# Altium schematic sheet Power.SchDoc
size A4; SheetNumber: 3; SheetTotal: 6
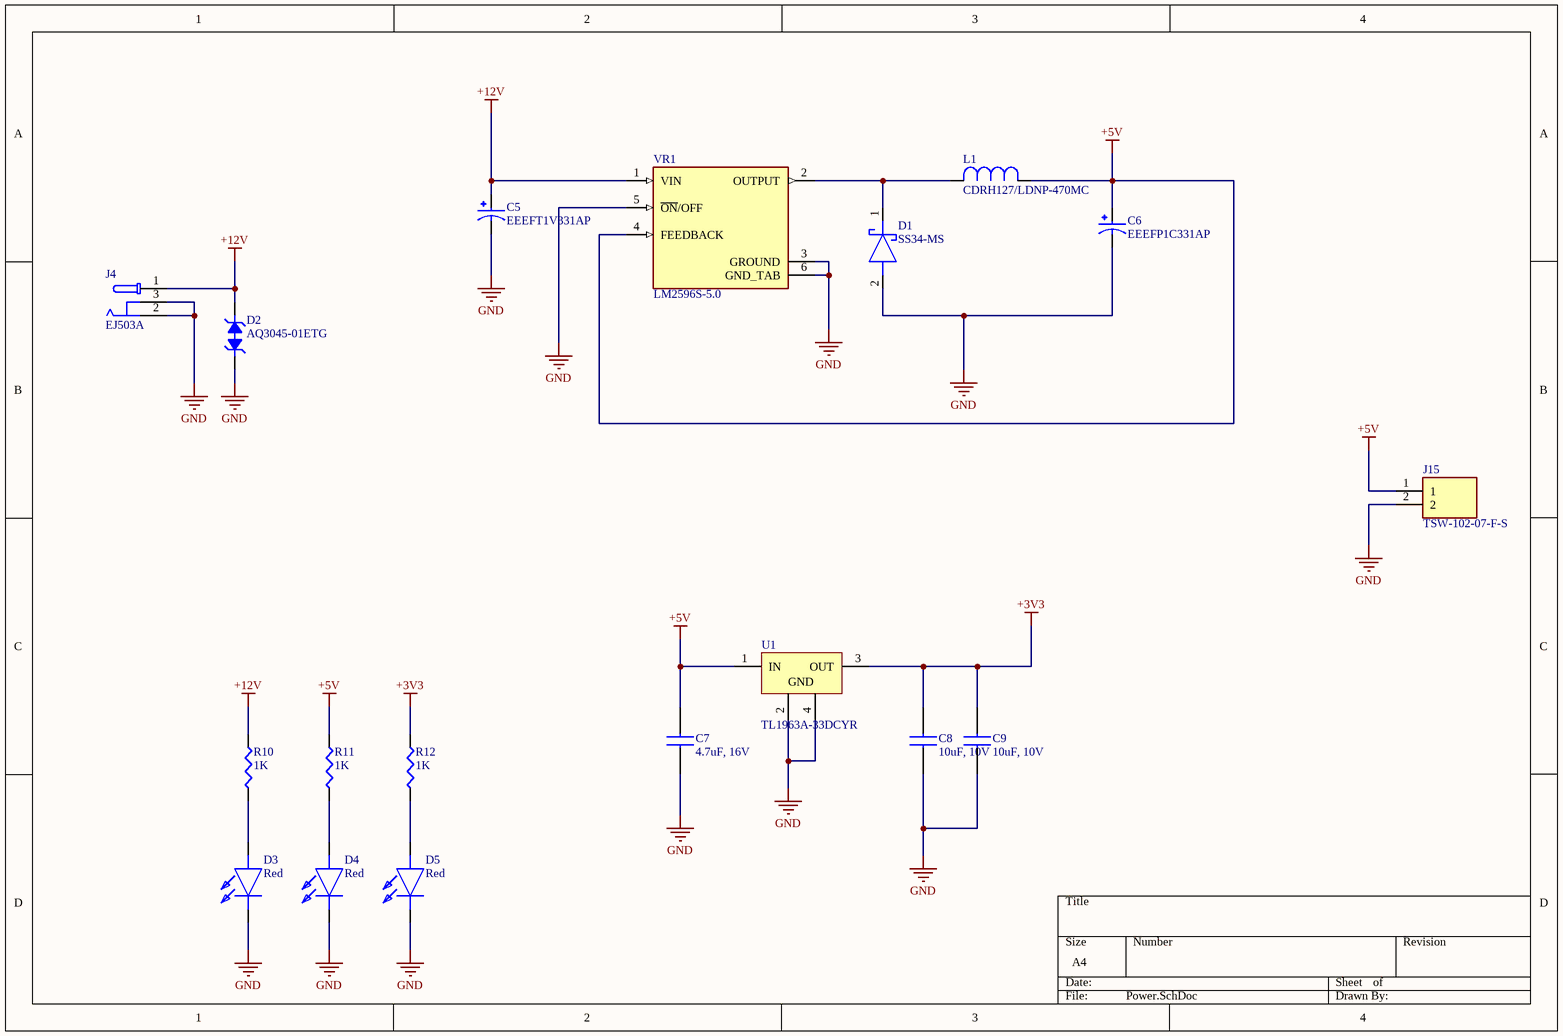
[diagram p0: Power.SchDoc]

## Parts
C5  EEEFT1V331AP  [CAP_EEEFT1V331AP]
C6  EEEFP1C331AP  [CAP_EEEFP1C331AP]
C7  4.7uF, 16V  [CAPC1608X90N]
C8  10uF, 10V  [CAPC1608X90N]
C9  10uF, 10V  [CAPC1608X90N]
D1  SS34-MS  [DIOM5127X241N]
D2  AQ3045-01ETG  [SOD882]
D3  Red  [LEDC1608X90N]
D4  Red  [LEDC1608X90N]
D5  Red  [LEDC1608X90N]
J4  EJ503A  [MPD_EJ503A]
J15  TSW-102-07-F-S  [TSW-102-XX-YY-S]
L1  CDRH127/LDNP-470MC  [IND_CDRH127/LDNP-470MC_SUM]
R10  1K  [RESC1607X60N]
R11  1K  [RESC1607X60N]
R12  1K  [RESC1607X60N]
U1  TL1963A-33DCYR  [DCY0004A_N]
VR1  LM2596S-5.0  [TO170P1524X483-6N]

## Nets
+3V3: C8.2 C9.2 R12.2 U1.3(OUT)
+5V: C6.1 C7.2 J15.1 L1.1 R11.2 U1.1(IN) VR1.4(FEEDBACK)
+12V: C5.1 D2.2 J4.1 R10.2 VR1.1(VIN)
GND: C5.2 C6.2 C7.1 C8.1 C9.1 D1.2(A) D2.1 D3.1(K) D4.1(K) D5.1(K) J4.2 J4.3 J15.2 U1.2(GND) U1.4(GND) VR1.3(GROUND) VR1.5(~{ON}/OFF) VR1.6(GND_TAB)
NetD1_1: D1.1(K) L1.2 VR1.2(OUTPUT)
NetD3_2: D3.2(A) R10.1
NetD4_2: D4.2(A) R11.1
NetD5_2: D5.2(A) R12.1

## Library data of the parts
C5 = EEEFT1V331AP: CAP ALUM 330UF 20% 35V SMD; MF: Panasonic Electronic; MP: EEE-FT1V331AP; SnapEDA_Link: https://www.snapeda.com/parts/EEE-FT1V331AP/Panasonic/view-part/?ref=snap; Package: RADIAL-2 Panasonic; Value: *; Check_prices: https://www.snapeda.com/parts/EEE-FT1V331AP/Panasonic/view-part/?ref=eda
C6 = EEEFP1C331AP: CAP ALUM 330UF 20% 16V SMD; MF: Panasonic Electronic; MP: EEE-FP1C331AP; SnapEDA_Link: https://www.snapeda.com/parts/EEE-FP1C331AP/Panasonic/view-part/?ref=snap; Package: RADIAL-2 Panasonic; Value: *; Check_prices: https://www.snapeda.com/parts/EEE-FP1C331AP/Panasonic/view-part/?ref=eda
C7 = CL10A475KO8NNNC: CAP CER 4,7UF 16V X5R 0603; Manufacturer_Name: SAMSUNG; Datasheet Link: https://componentsearchengine.com/Datasheets/2/CL10A106MP8NNNC.pdf; Height: 0.9mm; Manufacturer_Part_Number: CL10A475KO8NNNC; Mouser Part Number: 187-CL10A106MP8NNNC; Mouser Price/Stock: https://www.mouser.co.uk/ProductDetail/Samsung-Electro-Mechanics/CL10A106MP8NNNC?qs=X6jEic%2FHinAgjcVTZfg7UA%3D%3D; Arrow Part Number: CL10A106MP8NNNC; Arrow Price/Stock: https://www.arrow.com/en/products/cl10a106mp8nnnc/samsung-electro-mechanics?utm_currency=USD&region=europe
C8 C9 = CL10A106MP8NNNC: CAP CER 10UF 10V X5R 0603; Manufacturer_Name: SAMSUNG; Datasheet Link: https://componentsearchengine.com/Datasheets/2/CL10A106MP8NNNC.pdf; Height: 0.9mm; Manufacturer_Part_Number: CL10A106MP8NNNC; Mouser Part Number: 187-CL10A106MP8NNNC; Mouser Price/Stock: https://www.mouser.co.uk/ProductDetail/Samsung-Electro-Mechanics/CL10A106MP8NNNC?qs=X6jEic%2FHinAgjcVTZfg7UA%3D%3D; Arrow Part Number: CL10A106MP8NNNC; Arrow Price/Stock: https://www.arrow.com/en/products/cl10a106mp8nnnc/samsung-electro-mechanics?utm_currency=USD&region=europe
D1 = SS34-MS: Schottky Diode; Manufacturer_Name: MSKSEMI; Datasheet Link: https://datasheet.lcsc.com/lcsc/2202131930_MSKSEMI-SS34-MS_C2836396.pdf; Height: 2.41mm; Manufacturer_Part_Number: SS34-MS
D2 = AQ3045-01ETG: TVS DIODE 5.3VWM 12VC SOD882; Manufacturer: Littelfuse; Diode Element Material: SILICON; Package Body Material: Plastic; Polarity: Bidirectional; Max Breakdown Voltage: 9V; Min Breakdown Voltage: 6.8V; Diode Type: TRANS VOLTAGE SUPPRESSOR; Non-rep Peak Rev Power Dis-Max: 40W; Number of Elements: 1; Rep Pk Reverse Voltage-Max: 5.3V; Reference Standard: AEC-Q101; Supplier: Digikey; Supplier Part Number: F9321CT-ND; Manufacturer Part Number: AQ3045-01ETG; RoHS: Yes; Category: TVS Diodes; Stock: 21664; Pricing: 1=0.5, 10=0.391, 100=0.2344, 500=0.217, 1000=0.14756, 2000=0.13585, 5000=0.1302 (USD); Pins: 2; Package Shape: Rectangular; Min Operating Temperature: -55°C; Max Operating Temperature: 150°C; Package Style: CHIP CARRIERMeter; Surface Mount: Yes; Technology: AVALANCHE; Terminal Form: No Lead; Terminal Position: BOTTOM; Reach SVHC Compliant: Yes; RoHS Compliant: Yes; ComponentLink1URL: https://datasheet.ciiva.com:443/pdfs/VipMasterIC/IC/LFSI/LFSI-S-A0007892042/LFSI-S-A0007892042-1.pdf?src-supplier=IHS+Markit; ComponentLink1Description: https://datasheet.ciiva.com:443/pdfs/VipMasterIC/IC/LFSI/LFSI-S-A0007892042/LFSI-S-A0007892042-1.pdf?src-supplier=IHS+Markit; ComponentLink2URL: https://www.littelfuse.com/~/media/electronics/datasheets/tvs_diode_arrays/littelfuse_tvs_diode_array_aq3045_datasheet.pdf.pdf?src-supplier=Digikey; ComponentLink2Description: https://www.littelfuse.com/~/media/electronics/datasheets/tvs_diode_arrays/littelfuse_tvs_diode_array_aq3045_datasheet.pdf.pdf?src-supplier=Digikey; ComponentLink3URL: http://www.littelfuse.com/~/media/electronics/datasheets/tvs_diode_arrays/littelfuse_tvs_diode_array_aq3045_datasheet.pdf.pdf?src-supplier=Digikey; ComponentLink3Description: http://www.littelfuse.com/~/media/electronics/datasheets/tvs_diode_arrays/littelfuse_tvs_diode_array_aq3045_datasheet.pdf.pdf?src-supplier=Digikey; LCSC Part Number: C3710326
D3-D5 = HSMS-C190: Red LED 0603 (1608 Metric); Manufacturer_Name: Avago Technologies; Manufacturer_Part_Number: HSMG-C190; Datasheet Link: https://docs.broadcom.com/docs/AV02-0551EN; Height: 0.9mm; Mouser Part Number: 630-HSMG-C190; Mouser Price/Stock: https://www.mouser.co.uk/ProductDetail/Broadcom-Avago/HSMG-C190?qs=YDL0qNrpDT605sxOaps8VQ%3D%3D
J4 = EJ503A: Power Barrel Connector Jack 2.10mm ID (0.083), 5.50mm OD (0.217) Through Hole, Right Angle; MF: MPD; Package: None; Price: None; Check_prices: https://www.snapeda.com/parts/EJ503A/MPD+%2528Memory+Protection+Devices%2529/view-part/?ref=eda; Value: *; SnapEDA_Link: https://www.snapeda.com/parts/EJ503A/MPD+%2528Memory+Protection+Devices%2529/view-part/?ref=snap; MP: EJ503A; Availability: In Stock; Purchase-URL: https://pricing.snapeda.com/search?q=EJ503A&ref=eda
J15 = TSW-102-07-F-S: Connector; Manufacturer_Name: SAMTEC; Datasheet Link: http://suddendocs.samtec.com/prints/tsw-xxx-xx-xxx-x-xx-xxx-mkt.pdf; Manufacturer_Part_Number: TSW-102-07-F-S; Mouser Part Number: 200-TSW10207FS; Mouser Price/Stock: https://www.mouser.co.uk/ProductDetail/Samtec/TSW-102-07-F-S?qs=hzq9O0YpnZuC7JuvEqrjIA%3D%3D; Arrow Part Number: TSW-102-07-F-S; Arrow Price/Stock: https://www.arrow.com/en/products/tsw-102-07-f-s/samtec?utm_currency=USD&region=europe
L1 = CDRH127/LDNP-470MC: Inductor Power Shielded Drum Core 47uH 20% 1KHz Ferrite 4.1A 0.078Ohm DCR T/R; MF: Sumida Corporation; SnapEDA_Link: https://www.snapeda.com/parts/CDRH127/LDNP-470MC/Sumida/view-part/?ref=snap; Package: Non Standard Sumida; Value: *; MP: CDRH127/LDNP-470MC; Check_prices: https://www.snapeda.com/parts/CDRH127/LDNP-470MC/Sumida/view-part/?ref=eda
R10-R12 = RT0603BRD071KL: Fixed Resistor, Thin Film, 0.1W, 1000ohm, 75V, 0.1% +/-Tol, 25ppm/Cel, Surface Mount, 0603; Manufacturer: Yageo; Resistance: 1kR; Power Rating: 100mW; Temperature Coefficient: 25ppm/°C; Voltage Rating (DC): 50V; Supplier 1: Digikey; Manufacturer Part Number: RT0603BRD071KL; RoHS: Yes; Category: Chip SMD Resistors; Stock 1: 60333; Pricing 1: 1=0,15, 10=0,108, 50=0,0868, 100=0,0775, 500=0,06018, 1000=0,05202 (USD); Mount: Surface Mount; Case/Package: 0603; Case Code (Metric): 1608; Case Code (Imperial): 0603; Contact Plating: Tin,Lead; Size Code: 0603; Min Operating Temperature: -55°C; Max Operating Temperature: 155°C; Package Quantity: 5000; Packaging: Tape and Reel; Voltage Rating: 75V; Number of Terminations: 2; Termination: SMD/SMT; Max Power Dissipation: 100mW; Features: Moisture Resistant; Series: RT; Technology: THIN FILM; Length: 0.063inch; Width: 0.031inch; Height: 0.022inch; Depth: 0.8mm; RoHS Compliant: Yes; Lead Free: 5697LeadFree; ComponentLink1URL: https://datasheet.ciiva.com/11819/0900766b8079c86e-11819652.pdf?src-supplier=Rs; ComponentLink1Description: https://datasheet.ciiva.com/11819/0900766b8079c86e-11819652.pdf?src-supplier=Rs; ComponentLink2URL: https://datasheet.ciiva.com/5624/pyu-rt-1-to-0-05-rohs-l-4-5624759.pdf?src-supplier=Mouser; ComponentLink2Description: https://datasheet.ciiva.com/5624/pyu-rt-1-to-0-05-rohs-l-4-5624759.pdf?src-supplier=Mouser
U1 = TL1963A-33DCYR: IC REG LINEAR 3.3V 1.5A SOT223-4; Manufacturer: Texas Instruments; Package Body Material: Plastic; Adjustability: FIXED; Dropout Voltage1-Max: 550mV; Dropout Voltage1-Nom: 340mV; Input Voltage Absolute-Max: 20V; Min Input Voltage: 3.8V; Line Regulation-Max: 0.01%; Load Regulation-Max: 0.07%; Channels: 1; Output Voltage1-Max: 3.4V; Output Voltage1-Min: 3.2V; Regulator Type: FIXED POSITIVE SINGLE OUTPUT LDO REGULATOR; Voltage Tolerance-Max: 3%; Qualification Status: Not Qualified; Supplier: Digikey; Supplier Part Number: 296-24897-1-ND; Manufacturer Part Number: TL1963A-33DCYR; RoHS: Yes; Category: Voltage Regulators - Linear; Stock: 4105; Pricing: 1=2.91, 10=2.614, 25=2.4712, 100=2.1417, 250=2.03188, 500=1.8232, 1000=1.53764 (USD); Case/Package: SOP; Pins: 4; Package Shape: Rectangular; Terminal Finish: Tin; JESD-609 Code: e3; Max Supply Voltage: 20V; JESD-30 Code: R-PDSO-G4; Moisture Sensitivity Level: 2; Number of Outputs: 1; Operating Temperature, TJ-Max: 125°C; Operating Temperature, TJ-Min: -40°C; Output Current1-Max: 1.5A; Output Voltage1-Nom: 3.3V; Package Style: SMALL OUTLINEMeter; Packaging: Tape and Reel; Peak Reflow Temperature (Cel): 260°C; Surface Mount: Yes; Technology: BIPOLAR; Terminal Form: Gull Wing; Terminal Position: DUAL; Length: 6.5mm; Width: 3.5mm; Height - Seated (Max): 1.8mm; Terminal Pitch: 2.3mm; Reach SVHC Compliant: Yes; RoHS Compliant: Yes; ComponentLink1URL: https://www.ti.com:443/lit/ds/symlink/tl1963a.pdf?src-supplier=IHS+Markit; ComponentLink1Description: https://www.ti.com:443/lit/ds/symlink/tl1963a.pdf?src-supplier=IHS+Markit; ComponentLink2URL: https://datasheet.ciiva.com/2046/-2046068.pdf?src-supplier=Digikey; ComponentLink2Description: https://datasheet.ciiva.com/2046/-2046068.pdf?src-supplier=Digikey; LCSC Part Number: C181262
VR1 = LM2596S-5.0: SIMPLE SWITCHERÂ® 4.5V to 40V, 3A Low Component Count Step-Down Regulator; MF: Texas Instruments; MP: LM2596S-5.0/NOPB; SnapEDA_Link: https://www.snapeda.com/parts/LM2596S-5.0/NOPB/Texas+Instruments/view-part/?ref=snap; Package: TO-263-5 Texas Instruments; Value: *; Check_prices: https://www.snapeda.com/parts/LM2596S-5.0/NOPB/Texas+Instruments/view-part/?ref=eda